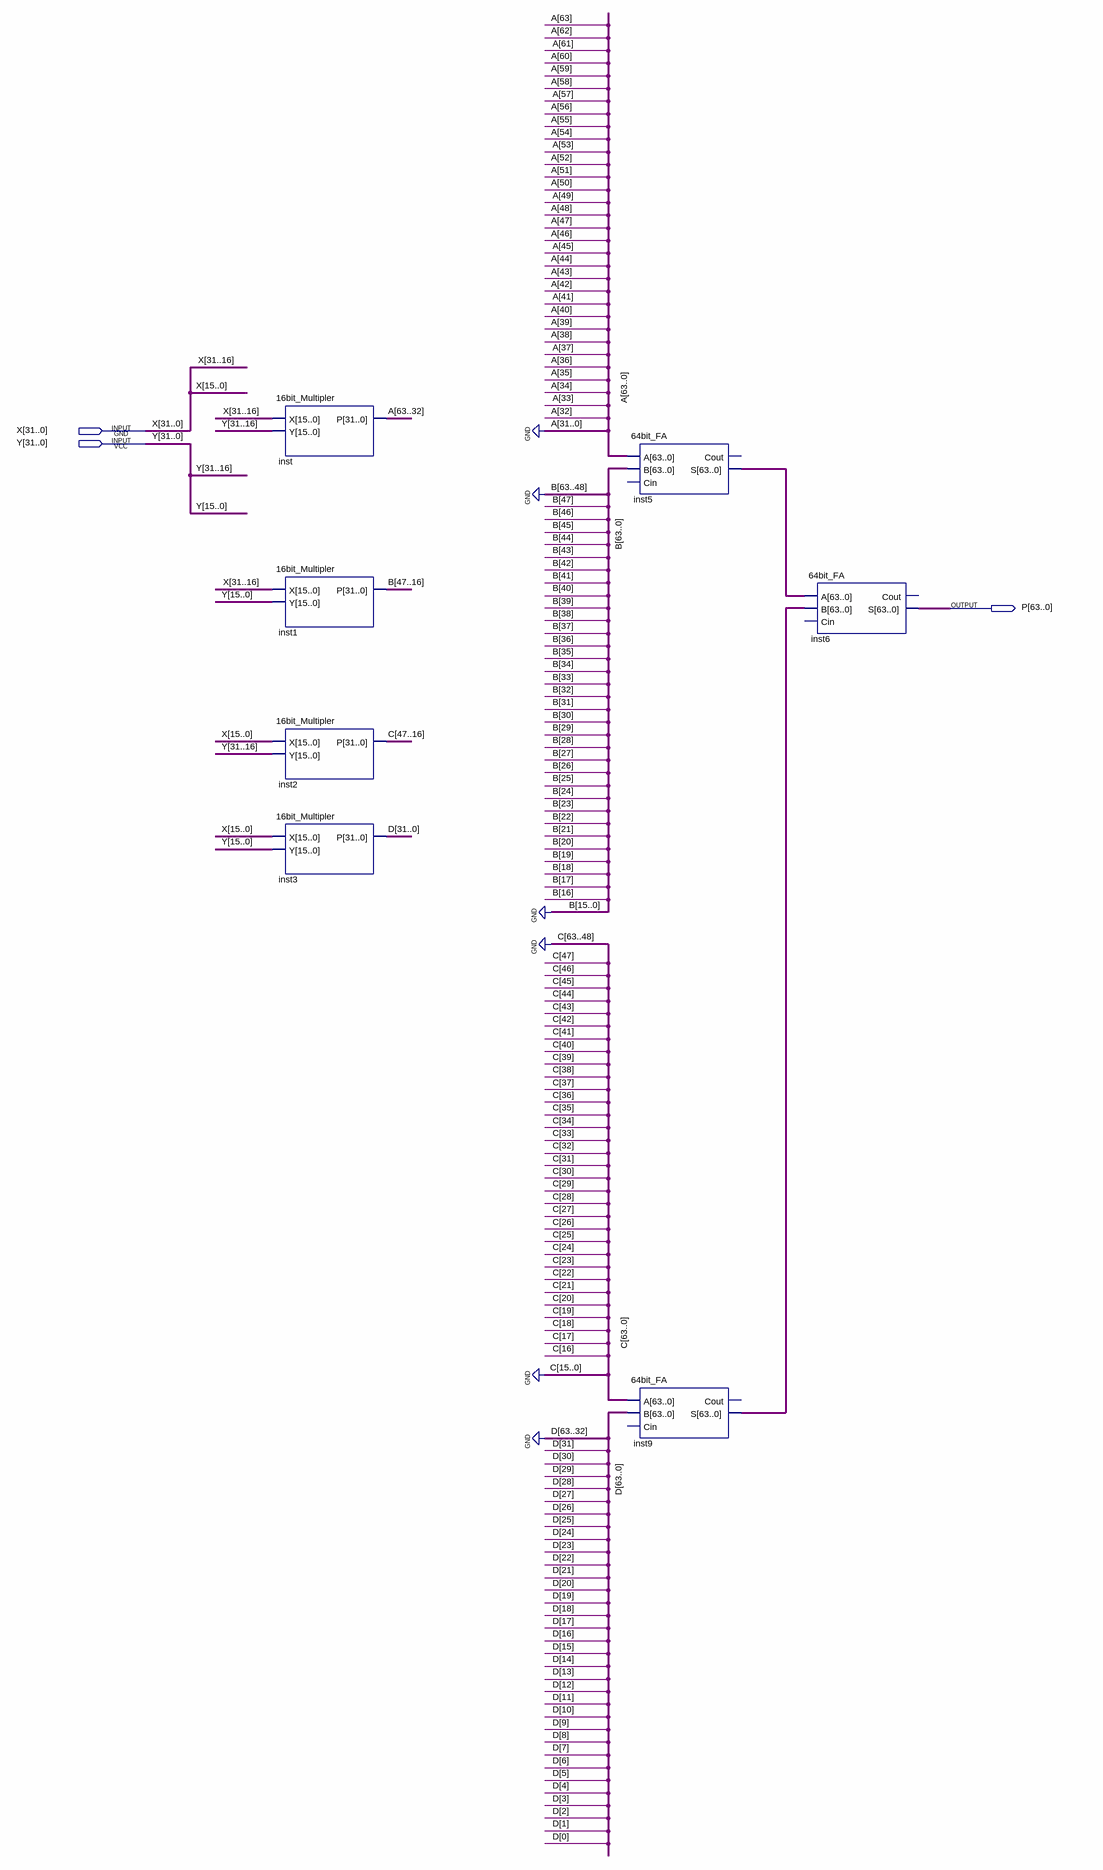
[diagram p0: schematic sheet]
// Quartus schematic 32bit_Multipler.bdf as structural Verilog: 7 symbols, 3 pins
module \32bit_Multipler  (
  input  [31:0] X,
  input  [31:0] Y,
  output [63:0] P
);

  wire [31:0] D;
  wire [47:16] B, C;
  wire [63:0] inst5_s, inst9_s;
  wire [63:32] A;

  \16bit_Multipler  inst (.X(X[31:16]), .Y(Y[31:16]), .P(A));
  \16bit_Multipler  inst1 (.X(X[31:16]), .Y(Y[15:0]), .P(B));
  \16bit_Multipler  inst2 (.X(X[15:0]), .Y(Y[31:16]), .P(C));
  \16bit_Multipler  inst3 (.X(X[15:0]), .Y(Y[15:0]), .P(D));
  \64bit_FA  inst5 (.A({A, {32{1'b0}}}), .B({{16{1'b0}}, B, {16{1'b0}}}), .S(inst5_s));  // open: Cin, Cout
  \64bit_FA  inst9 (.A({{16{1'b0}}, C, {16{1'b0}}}), .B({{32{1'b0}}, D}), .S(inst9_s));  // open: Cin, Cout
  \64bit_FA  inst6 (.A(inst5_s), .B(inst9_s), .S(P));  // open: Cin, Cout
endmodule
